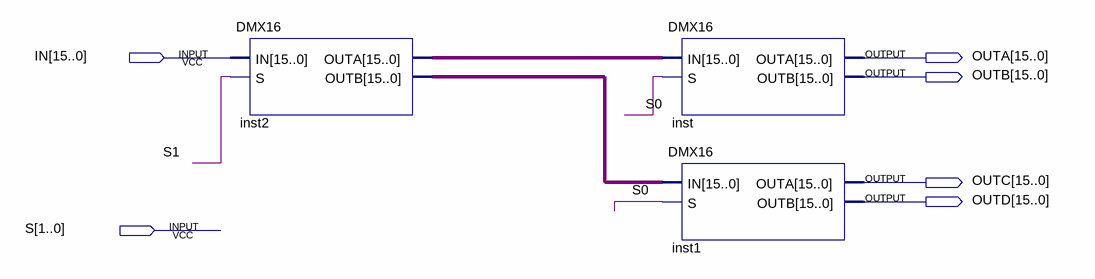
[diagram p0: schematic sheet]
// Quartus schematic DMX16TO4.bdf as structural Verilog: 3 symbols, 6 pins
module DMX16TO4 (
  input  [15:0] IN,
  input  [1:0] S,
  output [15:0] OUTA,
  output [15:0] OUTB,
  output [15:0] OUTC,
  output [15:0] OUTD
);

  wire [15:0] inst2_outa, inst2_outb;

  DMX16 inst2 (.IN(IN), .S(S[1]), .OUTA(inst2_outa), .OUTB(inst2_outb));
  DMX16 inst (.IN(inst2_outa), .S(S[0]), .OUTA(OUTA), .OUTB(OUTB));
  DMX16 inst1 (.IN(inst2_outb), .S(S[0]), .OUTA(OUTC), .OUTB(OUTD));
endmodule
